# EAGLE schematic ModuleCarrier-ODIN-W2 (EAGLE 7.7.0)

## Sheet 1 of 2
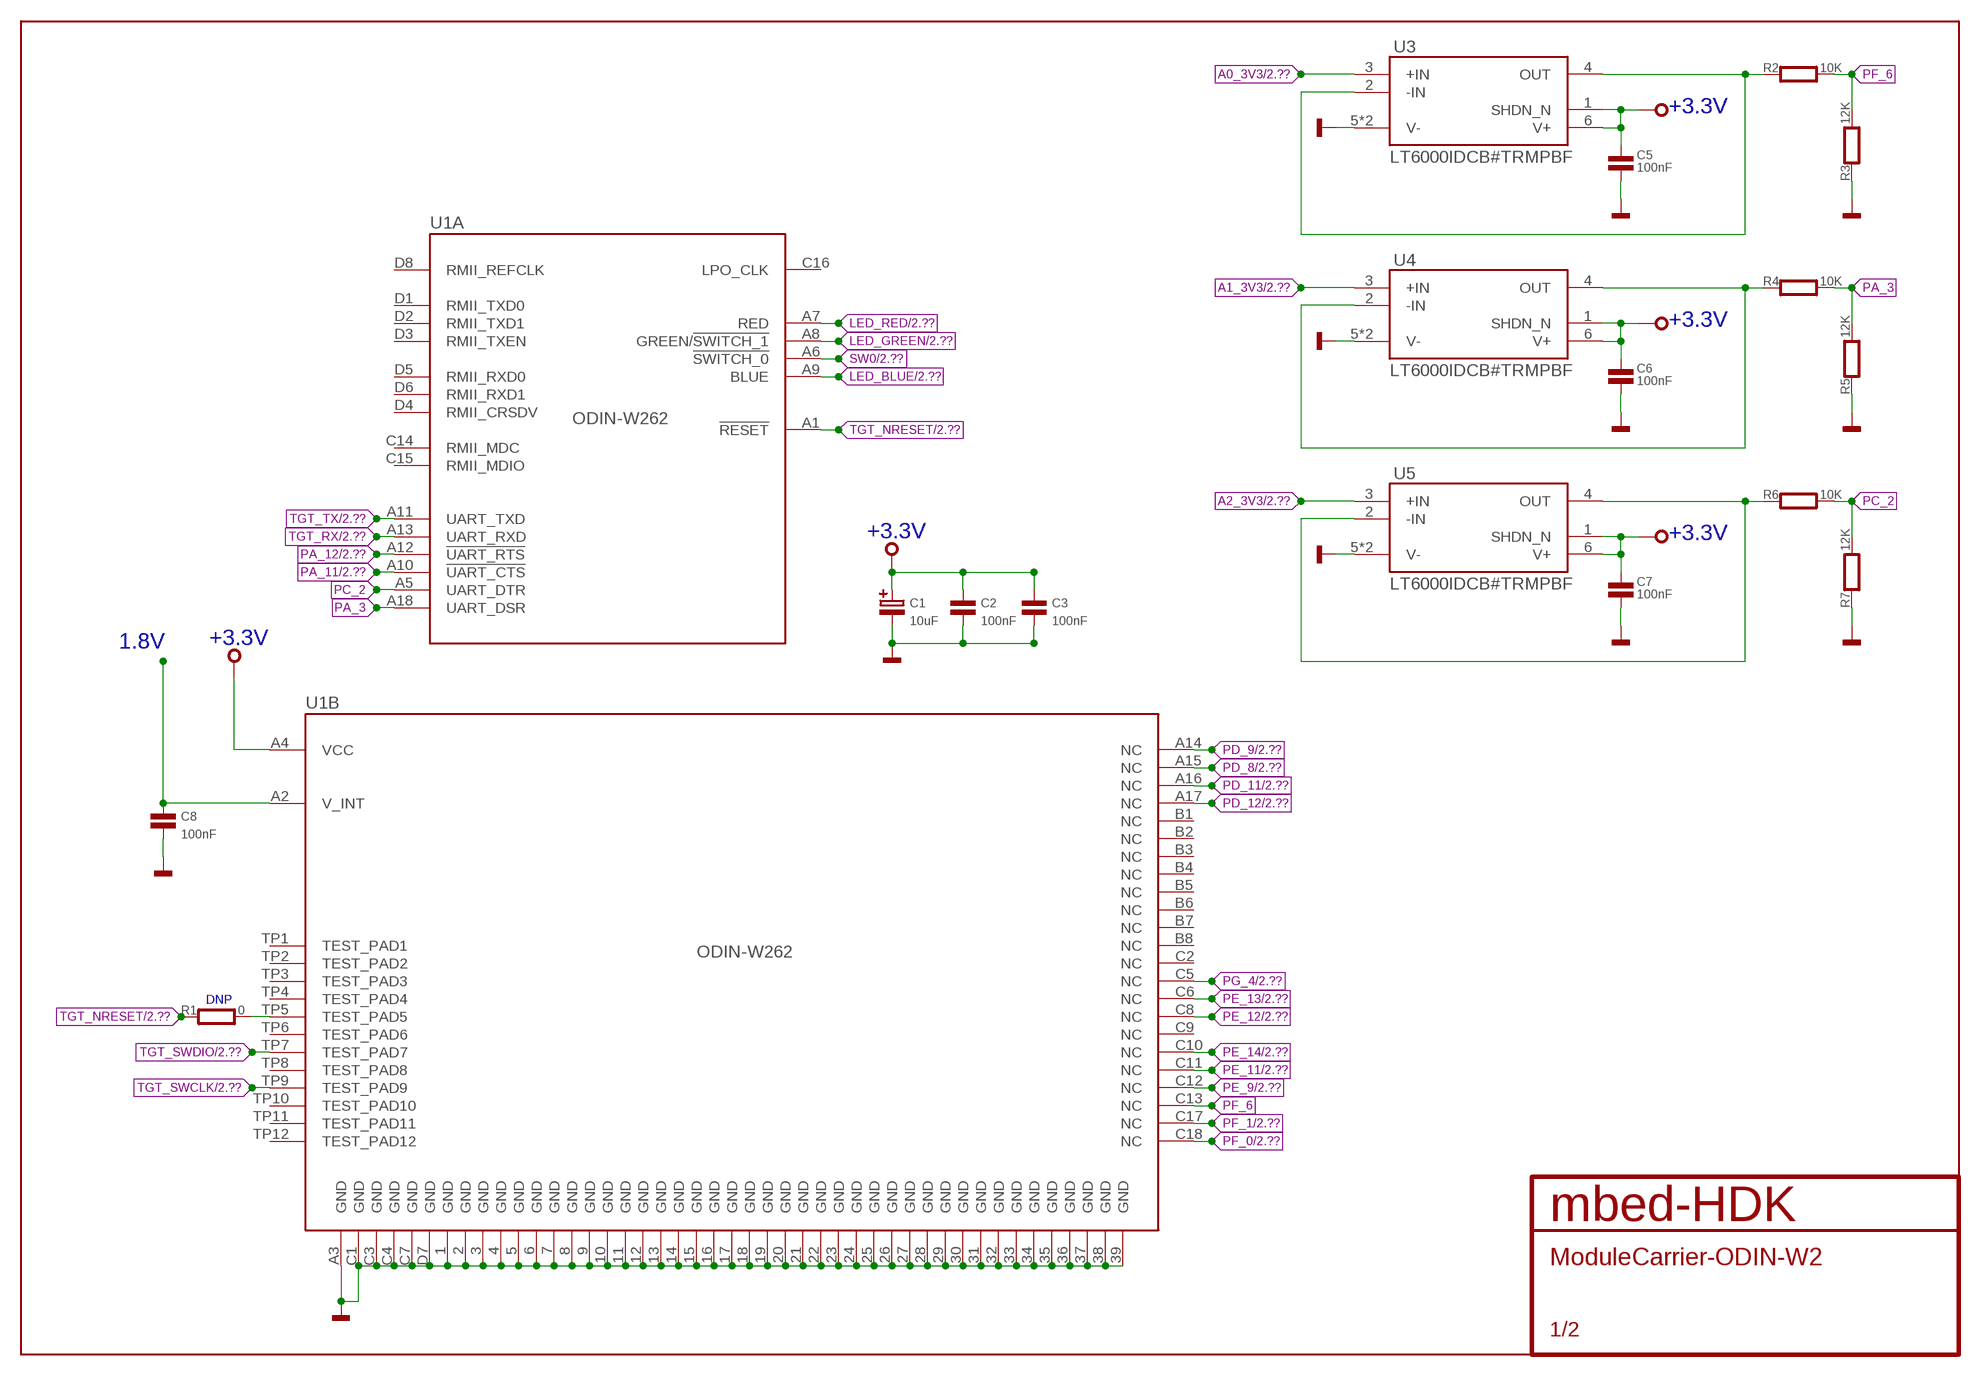
[diagram p0: schematic, sheet 1]

### Parts
C1  10uF  CAPACITOR-POLARISEDB  [SMC_B]
C2  100nF  CAPACITOR0603  [0603]
C3  100nF  CAPACITOR0603  [0603]
C5  100nF  CAPACITOR0603  [0603]
C6  100nF  CAPACITOR0603  [0603]
C7  100nF  CAPACITOR0603  [0603]
C8  100nF  CAPACITOR0603  [0603]
R1  0  RESISTOR0402  [0402]
R2  10K  RESISTOR0402  [0402]
R3  12K  RESISTOR0402  [0402]
R4  10K  RESISTOR0402  [0402]
R5  12K  RESISTOR0402  [0402]
R6  10K  RESISTOR0402  [0402]
R7  12K  RESISTOR0402  [0402]
U1  ODIN-W262  [ODIN-88]
U3  LT6000IDCB#TRMPBF  [6-DFN]
U4  LT6000IDCB#TRMPBF  [6-DFN]
U5  LT6000IDCB#TRMPBF  [6-DFN]

### Nets
1.8V: C8.1 U1.A2(B:V_INT) ; also sheet 2
+3.3V: C1.+ C2.1 C3.1 C5.1 C6.1 C7.1 U1.A4(B:VCC) U3.1(SHDN_N) U3.6(V+) U4.1(SHDN_N) U4.6(V+) U5.1(SHDN_N) U5.6(V+) ; also sheet 2
A0_3V3: U3.3(+IN) ; also sheet 2
A1_3V3: U4.3(+IN) ; also sheet 2
A2_3V3: U5.3(+IN) ; also sheet 2
GND: C1.- C2.2 C3.2 C5.2 C6.2 C7.2 C8.2 R3.1 R5.1 R7.1 U1.1(B:GND) U1.2(B:GND) U1.3(B:GND) U1.4(B:GND) U1.5(B:GND) U1.6(B:GND) U1.7(B:GND) U1.8(B:GND) U1.9(B:GND) U1.10(B:GND) U1.11(B:GND) U1.12(B:GND) U1.13(B:GND) U1.14(B:GND) U1.15(B:GND) U1.16(B:GND) U1.17(B:GND) U1.18(B:GND) U1.19(B:GND) U1.20(B:GND) U1.21(B:GND) U1.22(B:GND) U1.23(B:GND) U1.24(B:GND) U1.25(B:GND) U1.26(B:GND) U1.27(B:GND) U1.28(B:GND) U1.29(B:GND) U1.30(B:GND) U1.31(B:GND) U1.32(B:GND) U1.33(B:GND) U1.34(B:GND) U1.35(B:GND) U1.36(B:GND) U1.37(B:GND) U1.38(B:GND) U1.39(B:GND) U1.A3(B:GND) U1.C1(B:GND) U1.C3(B:GND) U1.C4(B:GND) U1.C7(B:GND) U1.D7(B:GND) U3.5(V-) U3.P$7(V-) U4.5(V-) U4.P$7(V-) U5.5(V-) U5.P$7(V-) ; also sheet 2
LED_BLUE: U1.A9(A:BLUE) ; also sheet 2
LED_GREEN: U1.A8(A:GREEN/!SWITCH_1) ; also sheet 2
LED_RED: U1.A7(A:RED) ; also sheet 2
N$1: R1.2 U1.TP5(B:TEST_PAD5)
N$2: R2.1 U3.2(-IN) U3.4(OUT)
N$3: R4.1 U4.2(-IN) U4.4(OUT)
N$4: R6.1 U5.2(-IN) U5.4(OUT)
PA_3: R4.2 R5.2 U1.A18(A:UART_DSR)
PA_11: U1.A10(A:!UART_CTS) ; also sheet 2
PA_12: U1.A12(A:!UART_RTS) ; also sheet 2
PC_2: R6.2 R7.2 U1.A5(A:UART_DTR)
PD_8: U1.A15(B:NC) ; also sheet 2
PD_9: U1.A14(B:NC) ; also sheet 2
PD_11: U1.A16(B:NC) ; also sheet 2
PD_12: U1.A17(B:NC) ; also sheet 2
PE_9: U1.C12(B:NC) ; also sheet 2
PE_11: U1.C11(B:NC) ; also sheet 2
PE_12: U1.C8(B:NC) ; also sheet 2
PE_13: U1.C6(B:NC) ; also sheet 2
PE_14: U1.C10(B:NC) ; also sheet 2
PF_0: U1.C18(B:NC) ; also sheet 2
PF_1: U1.C17(B:NC) ; also sheet 2
PF_6: R2.2 R3.2 U1.C13(B:NC)
PG_4: U1.C5(B:NC) ; also sheet 2
SW0: U1.A6(A:!SWITCH_0) ; also sheet 2
TGT_NRESET: R1.1 U1.A1(A:!RESET) ; also sheet 2
TGT_RX: U1.A13(A:UART_RXD) ; also sheet 2
TGT_SWCLK: U1.TP9(B:TEST_PAD9) ; also sheet 2
TGT_SWDIO: U1.TP7(B:TEST_PAD7) ; also sheet 2
TGT_TX: U1.A11(A:UART_TXD) ; also sheet 2
Unconnected: U1.B1(B:NC) U1.B2(B:NC) U1.B3(B:NC) U1.B4(B:NC) U1.B5(B:NC) U1.B6(B:NC) U1.B7(B:NC) U1.B8(B:NC) U1.C2(B:NC) U1.C9(B:NC) U1.C14(A:RMII_MDC) U1.C15(A:RMII_MDIO) U1.C16(A:LPO_CLK) U1.D1(A:RMII_TXD0) U1.D2(A:RMII_TXD1) U1.D3(A:RMII_TXEN) U1.D4(A:RMII_CRSDV) U1.D5(A:RMII_RXD0) U1.D6(A:RMII_RXD1) U1.D8(A:RMII_REFCLK) U1.TP1(B:TEST_PAD1) U1.TP2(B:TEST_PAD2) U1.TP3(B:TEST_PAD3) U1.TP4(B:TEST_PAD4) U1.TP6(B:TEST_PAD6) U1.TP8(B:TEST_PAD8) U1.TP10(B:TEST_PAD10) U1.TP11(B:TEST_PAD11) U1.TP12(B:TEST_PAD12)

### Notes on the sheet
- DNP

## Sheet 2 of 2
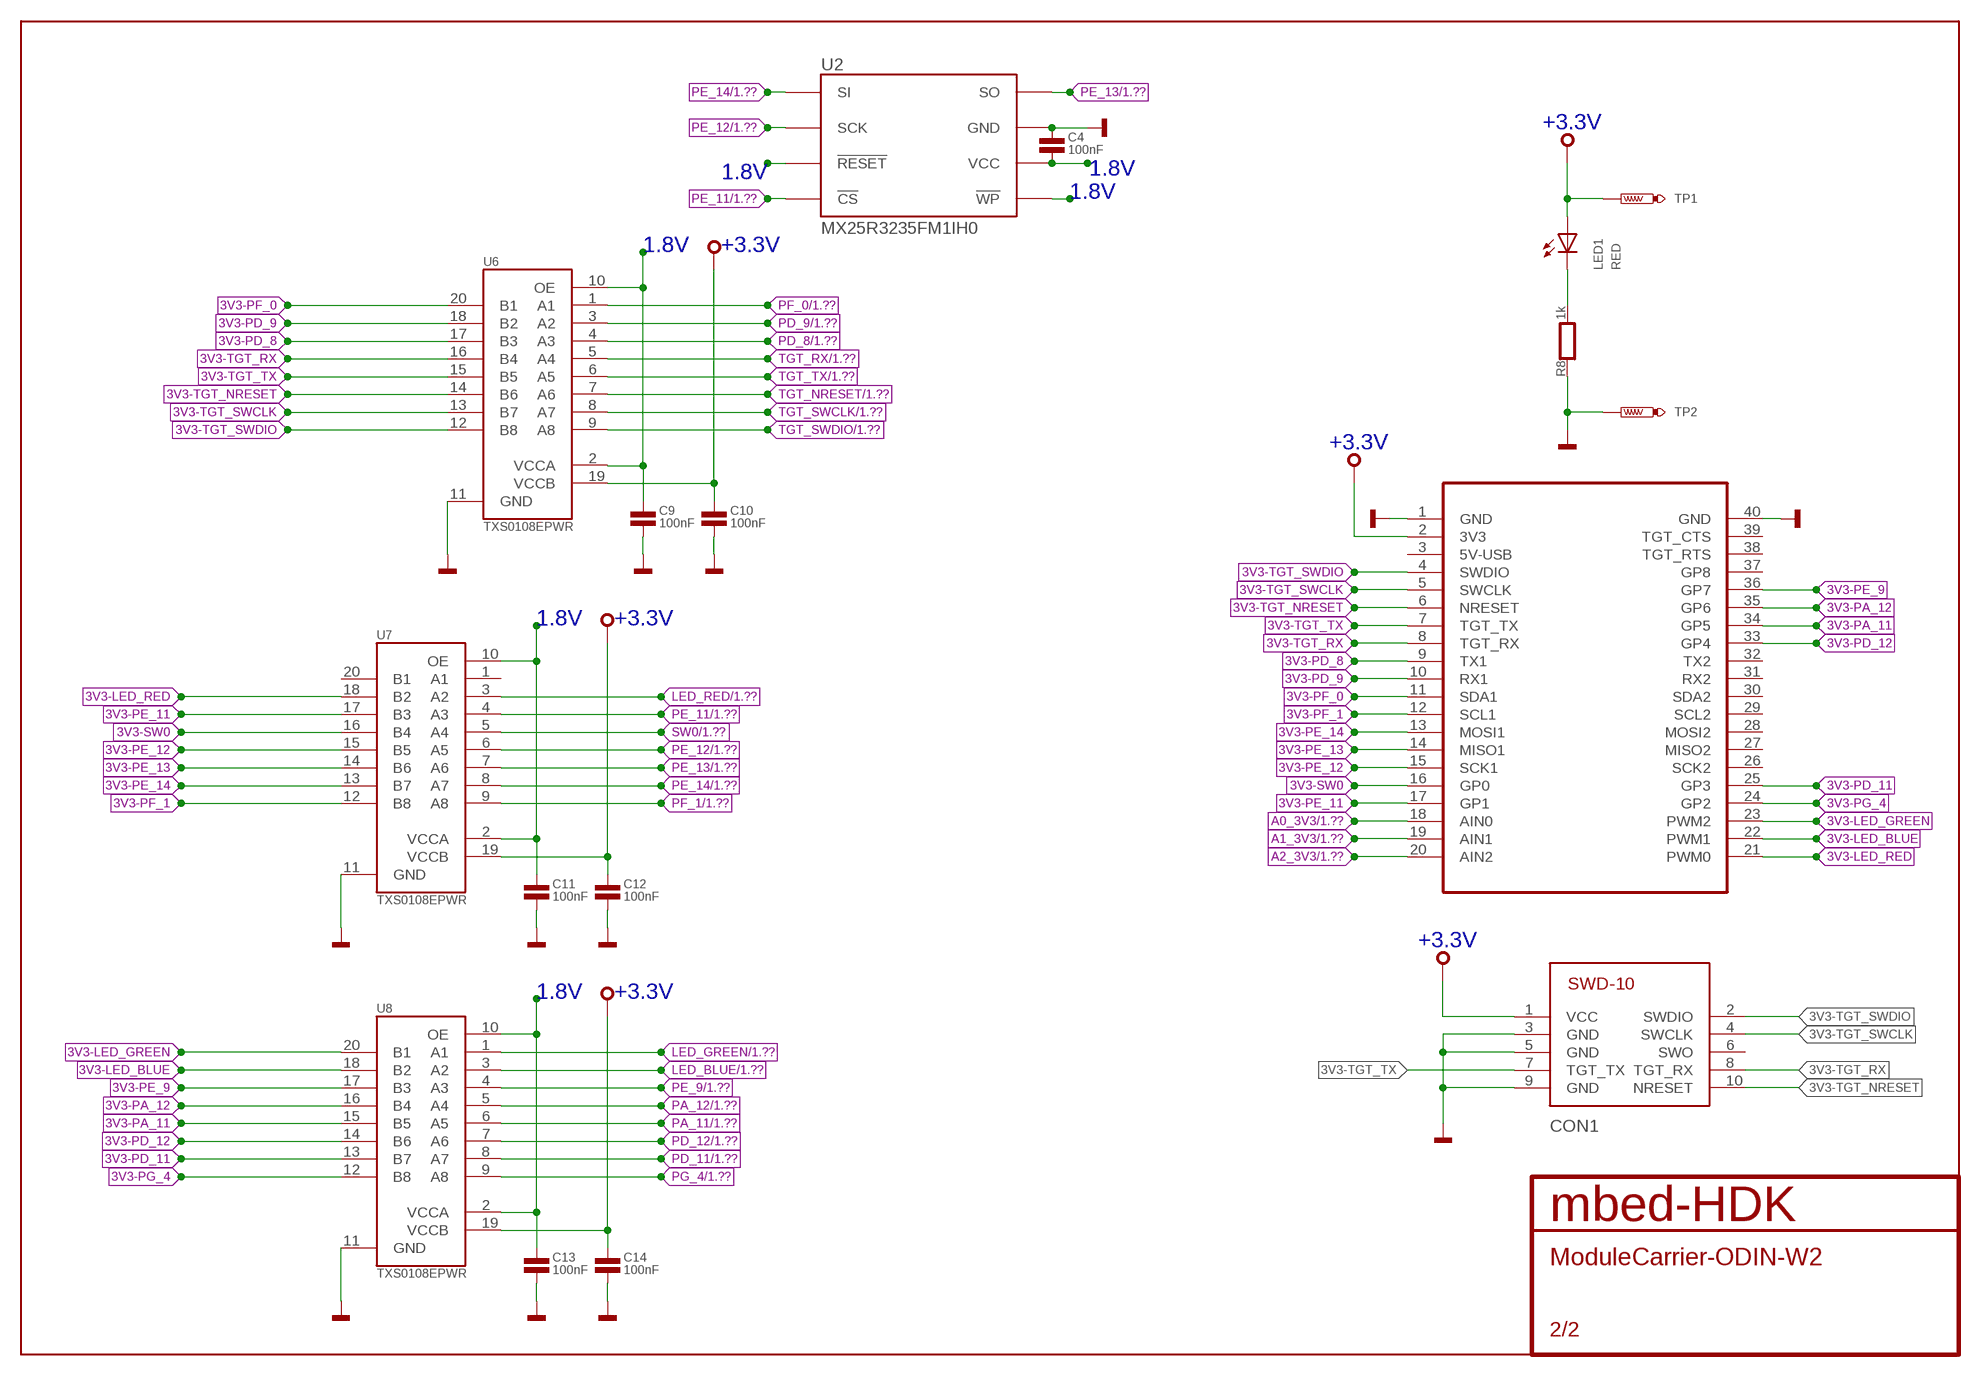
[diagram p1: schematic, sheet 2]

### Parts
C4  100nF  CAPACITOR0603  [0603]
C9  100nF  CAPACITOR0603  [0603]
C10  100nF  CAPACITOR0603  [0603]
C11  100nF  CAPACITOR0603  [0603]
C12  100nF  CAPACITOR0603  [0603]
C13  100nF  CAPACITOR0603  [0603]
C14  100nF  CAPACITOR0603  [0603]
CON1  SWD-10/TC2050_SMD  [FTSH-105-02]
LED1  RED  SMD_LED0603  [CHIPLED_0603]
R8  1k  RESISTOR0402  [0402]
TP1  TEST-POINT-50R-PTH  [TP50-PTH]
TP2  TEST-POINT-50R-PTH  [TP50-PTH]
U2  MX25R3235FM1IH0  [SO8]
U6  TXS0108EPWR  [TSSOP-20]
U7  TXS0108EPWR  [TSSOP-20]
U8  TXS0108EPWR  [TSSOP-20]
U$1  MODULE_DAUGHTER  [MODULE_DAUGHTER]

### Nets
1.8V: C4.2 C9.1 C11.1 C13.1 U2.3(!WP) U2.7(!RESET) U2.8(VCC) U6.2(VCCA) U6.10(OE) U7.2(VCCA) U7.10(OE) U8.2(VCCA) U8.10(OE) ; also sheet 1
3V3-LED_BLUE: U8.18(B2) U$1.22(PWM1)
3V3-LED_GREEN: U8.20(B1) U$1.23(PWM2)
3V3-LED_RED: U7.18(B2) U$1.21(PWM0)
3V3-PA_11: U8.15(B5) U$1.34(GP5)
3V3-PA_12: U8.16(B4) U$1.35(GP6)
3V3-PD_8: U6.17(B3) U$1.9(TX1)
3V3-PD_9: U6.18(B2) U$1.10(RX1)
3V3-PD_11: U8.13(B7) U$1.25(GP3)
3V3-PD_12: U8.14(B6) U$1.33(GP4)
3V3-PE_9: U8.17(B3) U$1.36(GP7)
3V3-PE_11: U7.17(B3) U$1.17(GP1)
3V3-PE_12: U7.15(B5) U$1.15(SCK1)
3V3-PE_13: U7.14(B6) U$1.14(MISO1)
3V3-PE_14: U7.13(B7) U$1.13(MOSI1)
3V3-PF_0: U6.20(B1) U$1.11(SDA1)
3V3-PF_1: U7.12(B8) U$1.12(SCL1)
3V3-PG_4: U8.12(B8) U$1.24(GP2)
3V3-SW0: U7.16(B4) U$1.16(GP0)
3V3-TGT_NRESET: CON1.10(NRESET) U6.14(B6) U$1.6(NRESET)
3V3-TGT_RX: CON1.8(TGT_RX) U6.16(B4) U$1.8(TGT_RX)
3V3-TGT_SWCLK: CON1.4(SWCLK) U6.13(B7) U$1.5(SWCLK)
3V3-TGT_SWDIO: CON1.2(SWDIO) U6.12(B8) U$1.4(SWDIO)
3V3-TGT_TX: CON1.7(TGT_TX) U6.15(B5) U$1.7(TGT_TX)
+3.3V: C10.1 C12.1 C14.1 CON1.1(VCC) LED1.A TP1.TP U6.19(VCCB) U7.19(VCCB) U8.19(VCCB) U$1.2(3V3) ; also sheet 1
A0_3V3: U$1.18(AIN0) ; also sheet 1
A1_3V3: U$1.19(AIN1) ; also sheet 1
A2_3V3: U$1.20(AIN2) ; also sheet 1
GND: C4.1 C9.2 C10.2 C11.2 C12.2 C13.2 C14.2 CON1.3(GND) CON1.5(GND) CON1.9(GND) R8.1 TP2.TP U2.4(GND) U6.11(GND) U7.11(GND) U8.11(GND) U$1.1(GND) U$1.40(GND) ; also sheet 1
LED_BLUE: U8.3(A2) ; also sheet 1
LED_GREEN: U8.1(A1) ; also sheet 1
LED_RED: U7.3(A2) ; also sheet 1
PA_1: LED1.C R8.2
PA_11: U8.6(A5) ; also sheet 1
PA_12: U8.5(A4) ; also sheet 1
PD_8: U6.4(A3) ; also sheet 1
PD_9: U6.3(A2) ; also sheet 1
PD_11: U8.8(A7) ; also sheet 1
PD_12: U8.7(A6) ; also sheet 1
PE_9: U8.4(A3) ; also sheet 1
PE_11: U2.1(!CS) U7.4(A3) ; also sheet 1
PE_12: U2.6(SCK) U7.6(A5) ; also sheet 1
PE_13: U2.2(SO) U7.7(A6) ; also sheet 1
PE_14: U2.5(SI) U7.8(A7) ; also sheet 1
PF_0: U6.1(A1) ; also sheet 1
PF_1: U7.9(A8) ; also sheet 1
PG_4: U8.9(A8) ; also sheet 1
SW0: U7.5(A4) ; also sheet 1
TGT_NRESET: U6.7(A6) ; also sheet 1
TGT_RX: U6.5(A4) ; also sheet 1
TGT_SWCLK: U6.8(A7) ; also sheet 1
TGT_SWDIO: U6.9(A8) ; also sheet 1
TGT_TX: U6.6(A5) ; also sheet 1
Unconnected: CON1.6(SWO) U7.1(A1) U7.20(B1) U$1.3(5V-USB) U$1.26(SCK2) U$1.27(MISO2) U$1.28(MOSI2) U$1.29(SCL2) U$1.30(SDA2) U$1.31(RX2) U$1.32(TX2) U$1.37(GP8) U$1.38(TGT_RTS) U$1.39(TGT_CTS)

## Library data of the parts
C1 = mbed-HDK-RLC:CAPACITOR-POLARISED: Polarised capacitor; MF: Kemet; MFN: T491B106K020AT; OC-DIGIKEY: 399-8298-1-ND; OC-MOUSER: 80-T491B106K020; OC-NEWARK: 57K1740
C2-C14 = mbed-HDK-RLC:CAPACITOR: Capacitor
CON1 = mbed-HDK-Connector:SWD-10/TC2050: 1mm pitch 10-Pin Cortex Programming Header with optional TC2050 footprint solderless interchangeable
LED1 = mbed-HDK-Optical:SMD_LED: LED SMD, Colour Red; MF: Wurth Electronics Inc; MFN: 150060RS75000; OC-DIGIKEY: 732-4978-1-ND; OC-MOUSER: 710-150060RS75000; OC-NEWARK: 2322071
R1-R8 = mbed-HDK-RLC:RESISTOR: Resistor
TP1 TP2 = mbed-HDK:TEST-POINT
U1 = mbed-HDK-MF-UBLOX:ODIN-W262: ODIN-W260: Host-based multiradio module with Wi-Fi and Bluetooth, internal antenna u-blox.com; MF: U-Blox America Inc.; MFN: ODIN-W262; OC-DIGIKEY: 672-1017-1-ND
U2 = mbed-HDK-IC:MX25R3235FM1IH0: Serial Flash 32 Mb 80 Mhz; MF: Macronix; MFN: MX25R3235FM2IH0; OC-DIGIKEY: 1092-1174-ND
U3-U5 = mbed-HDK-IC:LT6000IDCB#TRMPBF: IC OPAMP GBP 60KHZ RRO 6DFN; MF: Linear Technology; MFN: LT6000IDCB#TRMPBF; OC-DIGIKEY: LT6000IDCB#TRMPBFCT-ND; OC-NEWARK: 95M6567
U6-U8 = mbed-HDK-IC:TXS0108EPWR: 8-Bit Bi-directional, Level-Shifting, Voltage Translator; MF: Texas Instruments; MFN: TXS0108EPWR; OC-DIGIKEY: 296-23011-1-ND; OC-MOUSER: 595-TXS0108EPWR; OC-NEWARK: 05R8300
U$1 = Treadstone:MODULE_DAUGHTER